# Altium schematic sheet PTC Heater Driver.SchDoc
size A; SheetNumber: 8; SheetTotal: 19
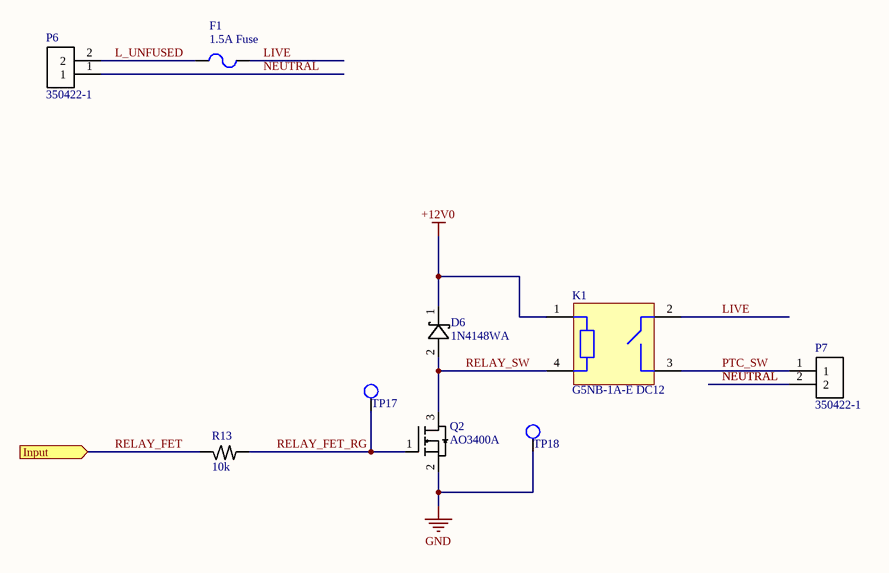
[diagram p0: PTC Heater Driver.SchDoc]

## Parts
D6  1N4148WA  [SOD-123W]
F1  1.5A Fuse  [2410 Fuse]
K1  G5NB-1A-E DC12  [G5NB-1A-E DC12 Relay]
P6  350422-1  [POWER2-5.08]
P7  350422-1  [POWER2-5.08]
Q2  AO3400A  [SOT23-3]
R13  10k  [R0603]
TP17  TestPoint  [TESTPOINT_SMD_1.27MM]  (value not drawn)  (no BOM)
TP18  TestPoint  [TESTPOINT_SMD_1.27MM]  (value not drawn)  (no BOM)

## Ports
Input (in)

## Nets
+12V0: D6.1 K1.1
GND: Q2.2(G) TP18.1
L_UNFUSED: F1.1 P6.2
LIVE: F1.2 K1.2
NEUTRAL: P6.1 P7.2
PTC_SW: K1.3 P7.1
RELAY_FET: R13.2 ; port Input
RELAY_FET_RG: Q2.1(G) R13.1 TP17.1
RELAY_SW: D6.2 K1.4 Q2.3(G)

## Notes on the sheet
- Project:
- Sheet Title:
- Size
- Date:
- A
- Sheet Number:
- Sheet Total:
- Revision:
- Time:
- Author:

## Library data of the parts
D6 = PMEG4020ETR-QX: DIODE GP 75V 150mA SOD-123W; MF: PJSEMI; MP: 1N4148WA; ComponentLink1Description: Datasheet; ComponentLink1URL: https://www.lcsc.com/datasheet/C2977359.pdf; ComponentLink2Description: Supplier1; ComponentLink2URL: https://www.lcsc.com/product-detail/C2977359.html
F1 = JFC2410-1150FS: FUSE BRD MNT 1.5A 250VAC/VDC 2410; MF: JDTfuse; ComponentLink1Description: Datasheet; ComponentLink1URL: https://www.lcsc.com/datasheet/C2994707.pdf; ComponentLink2Description: Supplier1; ComponentLink2URL: https://www.lcsc.com/product-detail/C2994707.html; MP: JFC2410-1150FS
K1 = G5NB-1A-E DC12 Relay: PCB Power Relay with 1-pole, 3A/5A Switching Capability and 10 kV Impulse Withstand Voltage; MF: OMRON; ComponentLink1Description: Datasheet; ComponentLink1URL: https://www.lcsc.com/datasheet/C225714.pdf; ComponentLink2Description: Supplier1; ComponentLink2URL: https://www.lcsc.com/product-detail/C225714.html; MP: G5NB-1A-E DC12
P6 P7 = Power2: PCB Mount Header, Vertical, Wire-to-Board, 2 Position, 5.08 mm [.2 in] Centerline, Fully Shrouded, Pre-Tin, Commercial MATE-N-LOK; MF: TE Connectivity; MP: 350422-1; ComponentLink1Description: Datasheet; ComponentLink1URL: https://www.te.com/commerce/DocumentDelivery/DDEController?Action=srchrtrv&DocNm=114-1012&DocType=Specification%20Or%20Standard&DocLang=English&DocFormat=pdf&PartCntxt=350422-1; ComponentLink2Description: Supplier1
Q2 = AO3400A: MOSFET N-CH 30V SOT-23-3L; MF: AOS; ComponentLink1Description: Supplier1; ComponentLink1URL: https://www.lcsc.com/product-detail/C20917.html; ComponentLink2Description: Datasheet; ComponentLink2URL: https://www.lcsc.com/datasheet/C20917.pdf; MP: AO3400A
R13 = Res: RES 10kΩ ±1% 100mW 0603; MF: FOJAN; MP: FRC0603F1002TS; ComponentLink1Description: Datasheet; ComponentLink1URL: https://www.lcsc.com/datasheet/C2906982.pdf; ComponentLink2Description: Supplier1; ComponentLink2URL: https://www.lcsc.com/product-detail/C2906982.html